# EAGLE design hv_in3 (EAGLE 9.3.1)
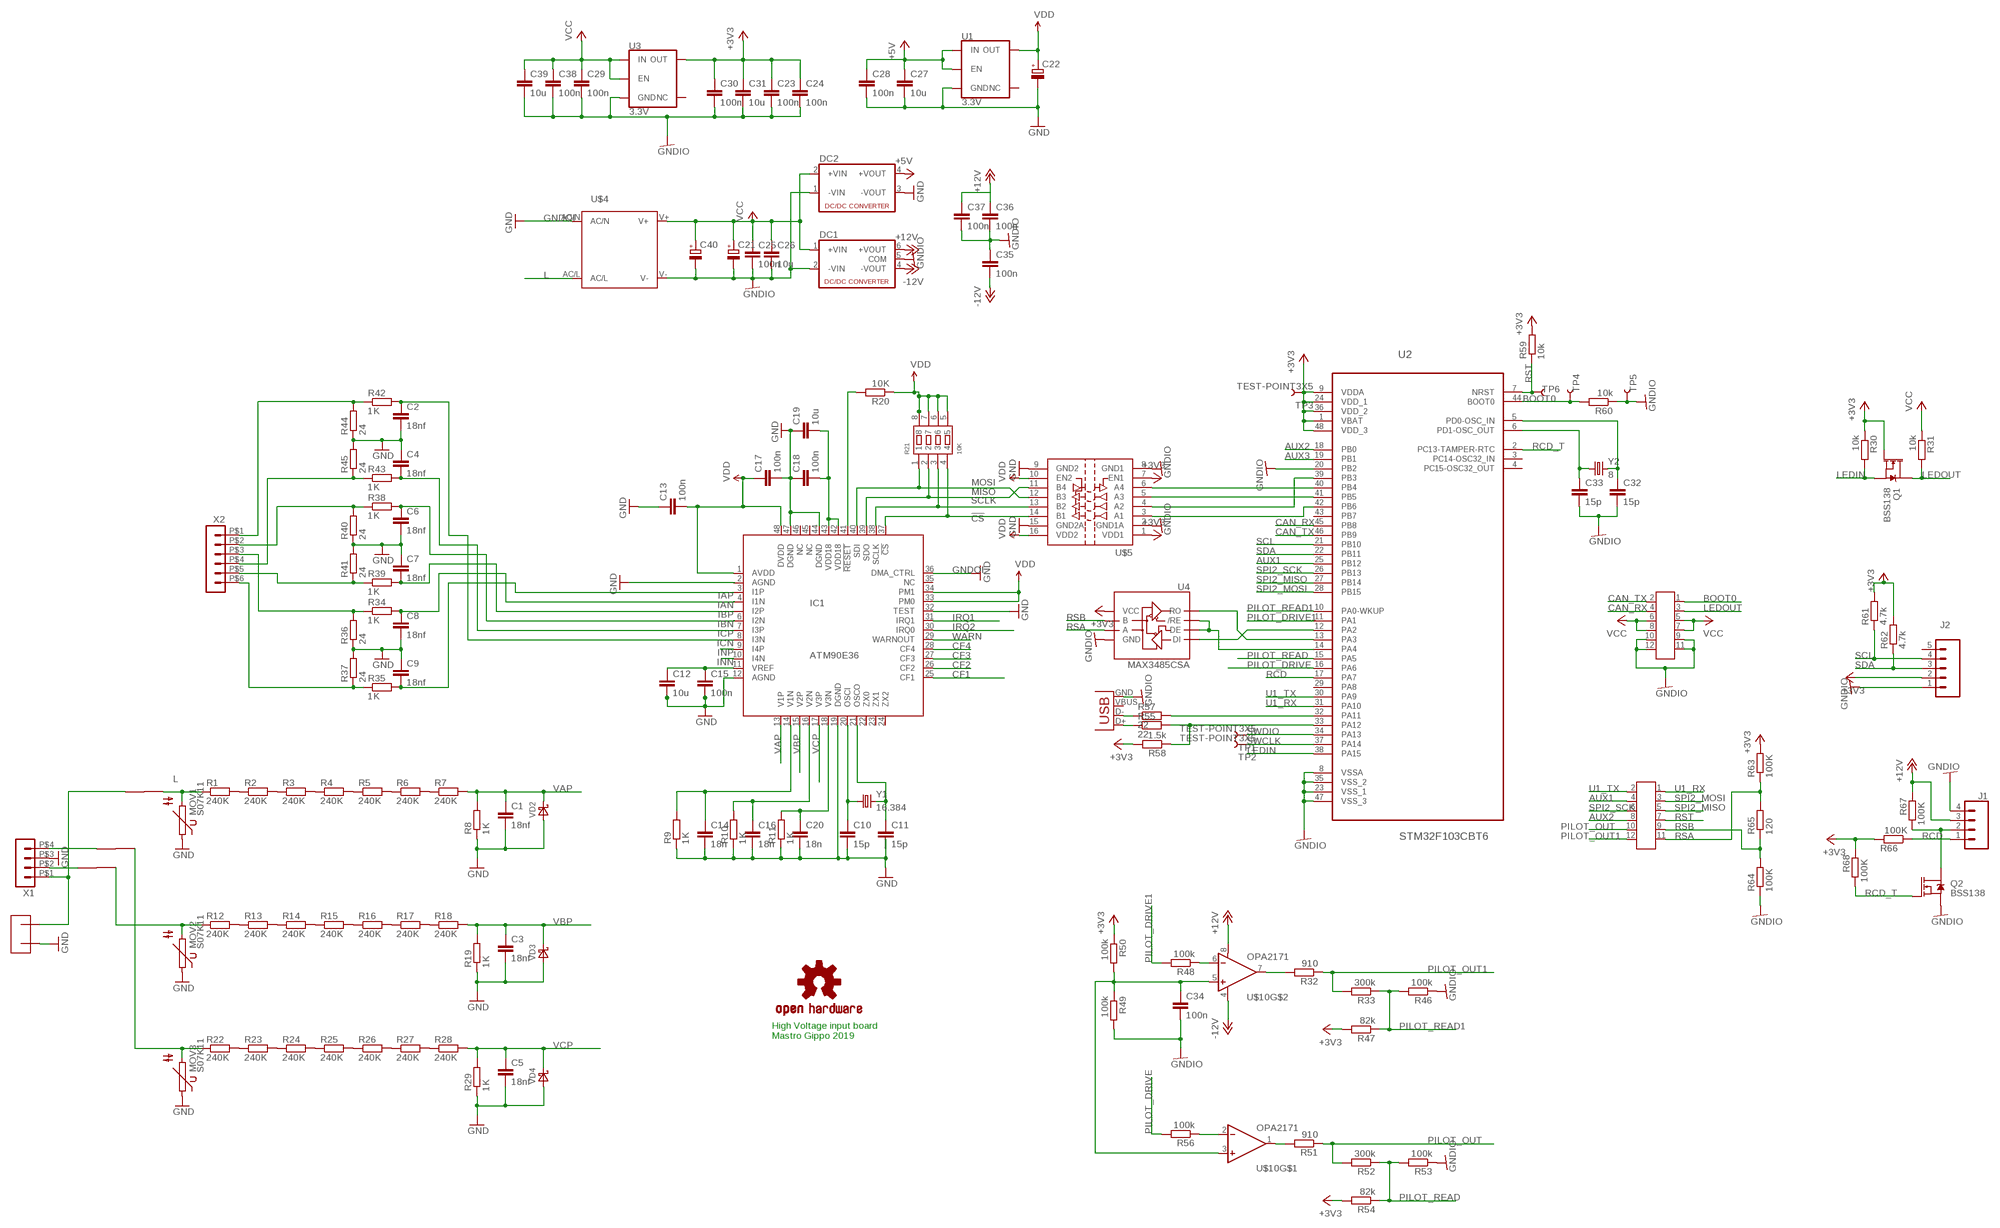
[diagram p0: schematic, sheet 1]

## Parts
C1  18nf  C-EUC0805K  [C0805K]
C2  18nf  C-EUC0805K  [C0805K]
C3  18nf  C-EUC0805K  [C0805K]
C4  18nf  C-EUC0805K  [C0805K]
C5  18nf  C-EUC0805K  [C0805K]
C6  18nf  C-EUC0805K  [C0805K]
C7  18nf  C-EUC0805K  [C0805K]
C8  18nf  C-EUC0805K  [C0805K]
C9  18nf  C-EUC0805K  [C0805K]
C10  15p  C-EUC0805K  [C0805K]
C11  15p  C-EUC0805K  [C0805K]
C12  10u  C-EUC0805K  [C0805K]
C13  100n  C-EUC0805K  [C0805K]
C14  18n  C-EUC0805K  [C0805K]
C15  100n  C-EUC0805K  [C0805K]
C16  18n  C-EUC0805K  [C0805K]
C17  100n  C-EUC0805K  [C0805K]
C18  100n  C-EUC0805K  [C0805K]
C19  10u  C-EUC0805K  [C0805K]
C20  18n  C-EUC0805K  [C0805K]
C21  CPOL-EU153CLV-0505  [153CLV-0505]
C22  CPOL-EU153CLV-0505  [153CLV-0505]
C23  100n  C-EUC0805K  [C0805K]
C24  100n  C-EUC0805K  [C0805K]
C25  100n  C-EUC0805K  [C0805K]
C26  10u  C-EUC0805K  [C0805K]
C27  10u  C-EUC0805K  [C0805K]
C28  100n  C-EUC0805K  [C0805K]
C29  100n  C-EUC0805K  [C0805K]
C30  100n  C-EUC0805K  [C0805K]
C31  10u  C-EUC0805K  [C0805K]
C32  15p  C-EUC0805K  [C0805K]
C33  15p  C-EUC0805K  [C0805K]
C34  100n  C-EUC0805K  [C0805K]
C35  100n  C-EUC0805K  [C0805K]
C36  100n  C-EUC0805K  [C0805K]
C37  100n  C-EUC0805K  [C0805K]
C38  100n  C-EUC0805K  [C0805K]
C39  10u  C-EUC0805K  [C0805K]
C40  CPOL-EUB/3528-21R  [B/3528-21R]
DC1  NMA  [NMA]
DC2  NME  [NME]
IC1  ATM90E36  [TQFP48]
J1  CONN_04SMD2  [1X04_1MM_RA]
J2  CONN_05SMD2  [1X05_1MM_RA]
MOV1  S07K11  [S07K11]
MOV2  S07K11  [S07K11]
MOV3  S07K11  [S07K11]
Q1  BSS138  MOSFET-NCH-BSS138  [SOT23-3]
Q2  BSS138  MOSFET-NCH-BSS138  [SOT23-3]
R1  240K  R_EU  [R0805]
R2  240K  R_EU  [R0805]
R3  240K  R_EU  [R0805]
R4  240K  R_EU  [R0805]
R5  240K  R_EU  [R0805]
R6  240K  R_EU  [R0805]
R7  240K  R_EU  [R0805]
R8  1K  R_EU  [R0805]
R9  1K  R_EU  [R0805]
R10  1K  R_EU  [R0805]
R11  1K  R_EU  [R0805]
R12  240K  R_EU  [R0805]
R13  240K  R_EU  [R0805]
R14  240K  R_EU  [R0805]
R15  240K  R_EU  [R0805]
R16  240K  R_EU  [R0805]
R17  240K  R_EU  [R0805]
R18  240K  R_EU  [R0805]
R19  1K  R_EU  [R0805]
R20  10K  R_EU  [R0805]
R21  10K  SMD-RES-ARRAY-1K-4R(RA1206-8)  [RA1206-8]
R22  240K  R_EU  [R0805]
R23  240K  R_EU  [R0805]
R24  240K  R_EU  [R0805]
R25  240K  R_EU  [R0805]
R26  240K  R_EU  [R0805]
R27  240K  R_EU  [R0805]
R28  240K  R_EU  [R0805]
R29  1K  R_EU  [R0805]
R30  10k  R-EU_R0805  [R0805]
R31  10k  R-EU_R0805  [R0805]
R32  910  R-EU_R1206  [R1206]
R33  300k  R-EU_R0805  [R0805]
R34  1K  R_EU  [R0805]
R35  1K  R_EU  [R0805]
R36  24  R_EU  [R0805]
R37  24  R_EU  [R0805]
R38  1K  R_EU  [R0805]
R39  1K  R_EU  [R0805]
R40  24  R_EU  [R0805]
R41  24  R_EU  [R0805]
R42  1K  R_EU  [R0805]
R43  1K  R_EU  [R0805]
R44  24  R_EU  [R0805]
R45  24  R_EU  [R0805]
R46  100k  R-EU_R0805  [R0805]
R47  82k  R-EU_R0805  [R0805]
R48  100k  R-EU_R0805  [R0805]
R49  100k  R-EU_R0805  [R0805]
R50  100k  R-EU_R0805  [R0805]
R51  910  R-EU_R1206  [R1206]
R52  300k  R-EU_R0805  [R0805]
R53  100k  R-EU_R0805  [R0805]
R54  82k  R-EU_R0805  [R0805]
R55  22  R-EU_R0805  [R0805]
R56  100k  R-EU_R0805  [R0805]
R57  22  R-EU_R0805  [R0805]
R58  1.5k  R-EU_R0805  [R0805]
R59  10k  R-EU_R0805  [R0805]
R60  10k  R-EU_R0805  [R0805]
R61  4.7k  R-EU_R0805  [R0805]
R62  4.7k  R-EU_R0805  [R0805]
R63  100K  R-EU_R0805  [R0805]
R64  100K  R-EU_R0805  [R0805]
R65  120  R-EU_R0805  [R0805]
R66  100K  R-EU_R0805  [R0805]
R67  100K  R-EU_R0805  [R0805]
R68  100K  R-EU_R0805  [R0805]
TP1  TEST-POINT3X5  [PAD.03X.05]
TP2  TEST-POINT3X5  [PAD.03X.05]
TP3  TEST-POINT3X5  [PAD.03X.05]
TP4  TEST-POINT3X5  [PAD.03X.05]
TP5  TEST-POINT3X5  [PAD.03X.05]
TP6  TEST-POINT3X5  [PAD.03X.05]
U1  3.3V  V_REG_AP2112K-3.3V  [SOT23-5]
U2  STM32F103CBT6  [QFP50P900X900X160-48N]
U3  3.3V  V_REG_AP2112K-3.3V  [SOT23-5]
U4  MAX3485CSA  RS485SOIC  [SO08]
U$1  FUSE_2410  [2410_F]
U$2  FUSE_2410  [2410_F]
U$3  FUSE_2410  [2410_F]
U$4  IRM_15/20IRM_15/20  [IRM_15/20]
U$5  SI8441IS1  [SO16]
U$6  ISOLATED_2P  [STRIP_NOMIDDLE]
U$7  CLP-106-02-F-D-P  [CLP-106-02-X-D]
U$8  CLP-106-02-F-D-P  [CLP-106-02-X-D]
U$9  OSHW-LOGOS  [OSHW-LOGO-S]
U$10  OPA2171  [SO08]
VD2  DIODE-SCHOTTKY-SOD523  [SOD523]
VD3  DIODE-SCHOTTKY-SOD523  [SOD523]
VD4  DIODE-SCHOTTKY-SOD523  [SOD523]
X1  HEADER_POS4_43045-0401  [43045-0400]
X2  HEADER_POS6_43045-0600  [43045-0600]
X3  USB-MICROB  [USB-MICROB]
Y1  16.384  CRYSTALSMD-3.2X2.5  [CRYSTAL-SMD-3.2X2.5MM]
Y2  8  CRYSTALSMD-3.2X2.5  [CRYSTAL-SMD-3.2X2.5MM]

## Nets
!CS: IC1.37(!CS) R21.4 U$5.14(B1)
+3V3: C23.1 C24.1 C30.1 C31.1 J2.2 Q1.1(G) R30.1 R47.2 R50.1 R54.2 R58.2 R59.2 R61.2 R62.2 R63.2 R66.2 R68.2 TP3.P$1 U2.1(VBAT) U2.9(VDDA) U2.24(VDD_1) U2.36(VDD_2) U2.48(VDD_3) U3.5(OUT) U4.8(VCC) U$5.1(VDD1) U$5.7(EN1)
+5V: C27.1 C28.1 DC2.4(+VOUT) U1.1(IN) U1.3(EN)
+12V: C36.1 C37.1 DC1.6(+VOUT) J1.3 R67.2 U$10.8(V+)
-12V: C35.2 DC1.4(-VOUT) U$10.4(V-)
AUX1: U2.25(PB12) U$7.4
AUX2: U2.18(PB0) U$7.8
AUX3: U2.19(PB1)
BOOT0: R60.2 TP4.P$1 U2.44(BOOT0) U$8.1
CAN_RX: U2.45(PB8) U$8.4
CAN_TX: U2.46(PB9) U$8.2
CF1: IC1.25(CF1)
CF2: IC1.26(CF2)
CF3: IC1.27(CF3)
CF4: IC1.28(CF4)
GNDIO: C21.- C23.2 C24.2 C25.2 C26.2 C29.2 C30.2 C31.2 C32.2 C33.2 C34.2 C35.1 C36.2 C37.2 C38.2 C39.2 C40.- DC1.2(-VIN) DC1.5(COM) DC2.1(-VIN) J1.4 J2.1 Q2.2(S) R46.1 R49.2 R53.1 R60.1 R64.1 TP5.P$1 U2.8(VSSA) U2.20(PB2) U2.23(VSS_1) U2.35(VSS_2) U2.47(VSS_3) U3.2(GND) U4.5(GND) U$4.V- U$5.2(GND1A) U$5.8(GND1) U$8.9 U$8.10 U$8.11 U$8.12 X3.GND
GNDOI: C1.2 C2.2 C3.2 C4.1 C5.2 C6.2 C7.1 C8.2 C9.1 C10.2 C11.2 C12.2 C13.1 C14.2 C15.2 C16.2 C17.2 C18.1 C19.1 C20.2 C22.- C27.2 C28.2 DC2.3(-VOUT) IC1.2(AGND) IC1.12(AGND) IC1.19(DGND) IC1.32(TEST) IC1.36(DMA_CTRL) IC1.44(DGND) IC1.47(DGND) MOV1.1 MOV2.1 MOV3.1 R8.1 R9.1 R10.1 R11.1 R19.1 R29.1 R36.1 R37.2 R40.1 R41.2 R44.1 R45.2 U1.2(GND) U$4.AC/N U$5.9(GND2) U$5.15(GND2A) U$6.P$2 VD2.A VD3.A VD4.A X1.P$3 ; supply symbol labelled GND
IAN [analog]: C8.1 IC1.4(I1N) R34.2
IAP [analog]: C9.2 IC1.3(I1P) R35.2
IBN [analog]: C6.1 IC1.6(I2N) R38.2
IBP [analog]: C7.2 IC1.5(I2P) R39.2
ICN [analog]: C2.1 IC1.8(I3N) R42.2
ICP [analog]: C4.2 IC1.7(I3P) R43.2
INN [analog]: IC1.10(I4N)
INP [analog]: IC1.9(I4P)
IRQ1: IC1.31(IRQ1)
IRQ2: IC1.30(IRQ0)
L: MOV1.2 R1.1 U$1.P$2 U$4.AC/L
LEDIN: Q1.2(S) R30.2 U2.38(PA15)
LEDOUT: Q1.3(D) R31.2 U$8.3
MISO: IC1.39(SDO) R21.2 U$5.11(B4)
MOSI: IC1.40(SDI) R21.1 U$5.12(B3)
N$1: U$3.P$2 X1.P$4
N$2: R1.2 R2.1
N$3: R2.2 R3.1
N$4: R3.2 R4.1
N$5: R4.2 R5.1
N$6: R5.2 R6.1
N$7: R6.2 R7.1
N$8: U$2.P$2 X1.P$2
N$9: MOV2.2 R12.1 U$2.P$1
N$10: C32.1 U2.5(PD0-OSC_IN) Y2.3
N$11: C33.1 U2.6(PD1-OSC_OUT) Y2.1
N$12: U$1.P$1 U$6.P$1 X1.P$1
N$13: U2.40(PB4) U$5.6(A4)
N$14: U2.41(PB5) U$5.5(A3)
N$15: R12.2 R13.1
N$16: R13.2 R14.1
N$17: R14.2 R15.1
N$18: R15.2 R16.1
N$19: R16.2 R17.1
N$20: R17.2 R18.1
N$21 [analog]: C14.1 IC1.14(V1N) R9.2
N$22 [analog]: C16.1 IC1.16(V2N) R10.2
N$23: U2.39(PB3) U$5.4(A2)
N$24 [analog]: C20.1 IC1.18(V3N) R11.2
N$25: MOV3.2 R22.1 U$3.P$1
N$26: R22.2 R23.1
N$27: R23.2 R24.1
N$28: R24.2 R25.1
N$29: R25.2 R26.1
N$30: R26.2 R27.1
N$31: R27.2 R28.1
N$32 [pwr]: C18.2 C19.2 IC1.42(VDD18) IC1.43(VDD18)
N$33: C10.1 IC1.20(OSCI) Y1.1
N$34: C11.1 IC1.21(OSCO) Y1.3
N$35: R34.1 R36.2 X2.P$3
N$36: R39.1 R41.1 X2.P$5
N$37: U2.42(PB6) U$5.3(A1)
N$38: R55.1 X3.D+
N$39: R57.1 X3.D-
N$40: R43.1 R45.1 X2.P$4
N$41: R57.2 U2.32(PA11)
N$42: R35.1 R37.1 X2.P$6
N$43: R42.1 R44.2 X2.P$1
N$44: R55.2 R58.1 U2.33(PA12)
N$45: R51.2 U$10.1(OUT)
N$46: R56.1 U$10.2(-IN)
N$47: R38.1 R40.2 X2.P$2
N$48: R48.1 U$10.6(-IN)
N$49: C34.1 R49.1 R50.2 U$10.3(+IN) U$10.5(+IN)
N$51: R32.2 U$10.7(OUT)
N$53: U2.12(PA2) U4.4(DI)
N$54: U2.13(PA3) U4.1(RO)
N$55: C12.1 C15.1 IC1.11(VREF)
N$56: U2.14(PA4) U4.2(/RE) U4.3(DE)
N$57: J1.2 Q2.3(D) R67.1
PILOT_DRIVE: R56.2 U2.16(PA6)
PILOT_DRIVE1: R48.2 U2.11(PA1)
PILOT_OUT: R51.1 R52.2 U$7.10
PILOT_OUT1: R32.1 R33.2 U$7.12
PILOT_READ: R52.1 R53.2 R54.1 U2.15(PA5)
PILOT_READ1: R33.1 R46.2 R47.1 U2.10(PA0-WKUP)
RCD: J1.1 R66.1 U2.17(PA7)
RCD_T: Q2.1(G) R68.1 U2.2(PC13-TAMPER-RTC)
RES: IC1.41(!RESET) R20.2
RSA: R63.1 R65.2 U4.6(A) U$7.11
RSB: R64.2 R65.1 U4.7(B) U$7.9
RST: R59.1 TP6.P$1 U2.7(NRST) U$7.7
SCL: J2.4 R61.1 U2.21(PB10)
SCLK: IC1.38(SCLK) R21.3 U$5.13(B2)
SDA: J2.3 R62.1 U2.22(PB11)
SPI2_MISO: U2.27(PB14) U$7.5
SPI2_MOSI: U2.28(PB15) U$7.3
SPI2_SCK: U2.26(PB13) U$7.6
SWCLK: TP2.P$1 U2.37(PA14)
SWDIO: TP1.P$1 U2.34(PA13)
U1_RX: U2.31(PA10) U$7.1
U1_TX: U2.30(PA9) U$7.2
VAP [analog]: C1.1 IC1.13(V1P) R7.2 R8.2 VD2.C
VBP [analog]: C3.1 IC1.15(V2P) R18.2 R19.2 VD3.C
VCC: C21.+ C25.1 C26.1 C29.1 C38.1 C39.1 C40.+ DC1.1(+VIN) DC2.2(+VIN) R31.1 U3.1(IN) U3.3(EN) U$4.V+ U$8.5 U$8.6 U$8.7 U$8.8
VCP [analog]: C5.1 IC1.17(V3P) R28.2 R29.2 VD4.C
VDD [pwr]: C13.2 C17.1 C22.+ IC1.1(AVDD) IC1.33(PM0) IC1.34(PM1) IC1.48(DVDD) R20.1 R21.5 R21.6 R21.7 R21.8 U1.5(OUT) U$5.10(EN2) U$5.16(VDD2)
WARN: IC1.29(WARNOUT)
Unconnected: IC1.22(ZX0) IC1.23(ZX1) IC1.24(ZX2) IC1.35(NC) IC1.45(NC) IC1.46(NC) J2.5 U1.4(NC) U2.3(PC14-OSC32_IN) U2.4(PC15-OSC32_OUT) U2.29(PA8) U2.43(PB7) U3.4(NC) X3.VBUS

## Notes on the sheet
- High Voltage input board
  Mastro Gippo 2019

## Library data of the parts
C1-C20 C23-C39 = resistor:C-EU: CAPACITOR, European symbol
C21 C22 C40 = rcl:CPOL-EU: POLARIZED CAPACITOR, European symbol; SPICEPREFIX: C
DC1 = dc-dc-converter:NMA: DC-DC CONVERTER; MF: C & D TECHNOLOGIES, INC; MPN: NMA0515SC; OC_FARNELL: 1021434; OC_NEWARK: 61K3064
DC2 = dc-dc-converter:NME: DC-DC CONVERTER; MF: C & D TECHNOLOGIES, INC; MPN: NME1205D; OC_FARNELL: 1021466; OC_NEWARK: 98B8198
IC1 = ATM90E36:ATM90E36: ATMEL Poly-phase energy metering; OC_FARNELL: unknown; OC_NEWARK: unknown
J1 = SparkFun-Connectors:CONN_04: Multi connection point. Often used as Generic Header-pin footprint for 0.1 inch spaced/style header connections On any of the 0.1 inch spaced packages, you can populate with these: Break Away Headers - Straight <https://www.sparkfun.com/products/116> (PRT-00116) Break Away Male Headers - Right Angle <https://www.sparkfun.com/products/553> (PRT-00553) Female Headers <https://www.sparkfun.com/products/115> (PRT-00115) Break Away Headers - Machine Pin <https://www.sparkfun.com/products/117> (PRT-00117) Break Away Female Headers - Swiss Machine Pin <https://www.sparkfun.com/products/743> (PRT-00743) For SCREWTERMINALS and SPRING TERMINALS visit here: Screw Terimnals on SparkFun.com <https://www.sparkfun.com/search/results?term=Screw+Terminals> (5mm/3.5mm/2.54mm spacing) This device is also useful as a general connection point to wire up your design to another part of your project. Our various solder wires solder well into these plated through hole pads. Hook-Up Wire - Assortment (Stranded, 22 AWG) <https://www.sparkfun.com/products/11375> (PRT-11375) Hook-Up Wire - Assortment (Solid Core, 22 AWG) <https://www.sparkfun.com/products/11367> (PRT-11367) View the entire wire category on our website here <https://www.sparkfun.com/categories/141> Special notes: Molex polarized connector foot print use with SKU : PRT-08231 with associated crimp pins and housings. 1MM SMD Version SKU: PRT-10208; PROD_ID: CONN-10310; SF_ID: PRT-10208
J2 = SparkFun-Connectors:CONN_05: Multi connection point. Often used as Generic Header-pin footprint for 0.1 inch spaced/style header connections On any of the 0.1 inch spaced packages, you can populate with these: Break Away Headers - Straight <https://www.sparkfun.com/products/116> (PRT-00116) Break Away Male Headers - Right Angle <https://www.sparkfun.com/products/553> (PRT-00553) Female Headers <https://www.sparkfun.com/products/115> (PRT-00115) Break Away Headers - Machine Pin <https://www.sparkfun.com/products/117> (PRT-00117) Break Away Female Headers - Swiss Machine Pin <https://www.sparkfun.com/products/743> (PRT-00743) For SCREWTERMINALS and SPRING TERMINALS visit here: Screw Terimnals on SparkFun.com <https://www.sparkfun.com/search/results?term=Screw+Terminals> (5mm/3.5mm/2.54mm spacing) This device is also useful as a general connection point to wire up your design to another part of your project. Our various solder wires solder well into these plated through hole pads. Hook-Up Wire - Assortment (Stranded, 22 AWG) <https://www.sparkfun.com/products/11375> (PRT-11375) Hook-Up Wire - Assortment (Solid Core, 22 AWG) <https://www.sparkfun.com/products/11367> (PRT-11367) View the entire wire category on our website here <https://www.sparkfun.com/categories/141> Special notes: Molex polarized connector foot print use with SKU : PRT-08231 with associated crimp pins and housings. 1MM SMD Version SKU: PRT-10208
MOV1-MOV3 = varistor:S07K11: VARISTOR
Q1 Q2 = SparkFun-DiscreteSemi:MOSFET-NCH: N-channel MOSFETs Voltage controlled devices that allow control of high current outputs. SparkFun Products: SparkFun OpenScale <https://www.sparkfun.com/products/13261> SparkFun Digital Sandbox <https://www.sparkfun.com/products/12651> SparkFun Monster Moto Shield <https://www.sparkfun.com/products/10182> SparkFun MOSFET Power Controller <https://www.sparkfun.com/products/11214>; PROD_ID: TRANS-00830; VALUE: 220mA/50V/3.5Ω
R1-R20 R22-R29 R34-R45 = mastrogippo:R_EU
R21 = Seeed-Resistor-2016:SMD-RES-ARRAY-1K-4R(RA1206-8): 301030012; MPN: Chip-Array-Series-1%; VALUE: 1K
R30-R33 R46-R68 = resistor:R-EU_: RESISTOR, European symbol
TP1-TP6 = SparkFun:TEST-POINT
U1 U3 = SparkFun-IC-Power:V_REG_AP2112: AP2112 - 600mA CMOS LDO Regulator w/ Enable The AP2112 is CMOS process low dropout linear regulator with enable function, the regulator delivers a guaranteed 600mA (min.) continuous load current. Features Output Voltage Accuracy: ±1.5% Output Current: 600mA (Min.) Foldback Short Current Protection: 50mA Enable Function to Turn ON/OFF VOUT Low Dropout Voltage (3.3V): 250mV (Typ.) @IOUT=600mA Excellent Load Regulation: 0.2%/A (Typ.) Excellent Line Regulation: 0.02%/V (Typ.) Low Quiescent Current: 55μA (Typ.) Low Standby Current: 0.01μA (Typ.) Low Output Noise: 50μVRMS PSRR: 100Hz -65dB, 1kHz -65dB OTSD Protection Stable with 1.0μF Flexible Cap: Ceramic, Tantalum and Aluminum Electrolytic Operation Temperature Range: -40°C to 85°C ESD: MM 400V, HBM 4000V; PROD_ID: VREG-12457
U2 = ST Microelctronics_By_element14_Batch_1:STM32F103CBT6: Medium-density performance line ARM-based 32-bit MCU; MPN: STM32F103CBT6; OC_FARNELL: 1606327; OC_NEWARK: 11N8296; PACKAGE: QFP-48; SUPPLIER: STMICROELECTRONICS
U4 = SparkFun-IC-Comms:RS485: RS-485 Transceiver SP3485 Series 8 Pin NSOIC 3.3 V Low Power Half Duplex RS-485 Transceiver MAX3485 compatible Datasheet <http://www.sparkfun.com/datasheets/Components/General/sp3485CN-LTR.pdf> SparkFun Products SparkFun Transceiver Breakout - RS-485 <https://www.sparkfun.com/products/10124> (BOB-10124) SparkFun USB to RS-485 Converter <https://www.sparkfun.com/products/9822> (BOB-09822); PROD_ID: IC-09388
U$1-U$3 = mastrogippo:FUSE_2410
U$4 = meanwell_irm_v7:IRM_15/20: 15 or 20 watt housing & pin compatible IRM 15 Vout [V] Imax [A] Pmax [W] Eff [%] 3.3 3.5 11.55 74 5 3 15 78 12 1.25 15 82 15 1 15 82 24 0.63 15.12 83 IRM 20 Vout [V] Imax [A] Pmax [W] Eff [%] 3.3 4.5 14.85 76 5 4 20 79 12 1.8 21.6 84 15 1.4 21.6 84 24 0.9 21.6 85
U$5 = silicon-labs:SI8441: Si8441 4 Channel (3/1) Digital Isolator Silicon Labs Si84xx ISOpro digital isolator series. The Si84xx ISOpro digital isolators provide low power galvanic isolation for digital signals. The '41 has three forward and one reverse channel, with output enables. This part is suitable for four wire SPI: unidirectional signals with clock and chip select. They come in speeds of 1Mbps and 150Mbps, and isolation ratings of 1KV, 2.5KV and 5KV. The independent sides use 2.7-5.5V supplies and draw under 5mA per channel. Donald Becker
U$6 = mastrogippo:ISOLATED_2P
U$7 U$8 = mastrogippo:CLP-106-02-F-D-P
U$9 = mastrogippo:OSHW-LOGO: Open Source Hardware Logo This logo indicates the piece of hardware it is found on incorporates a OSHW license and/or adheres to the definition of open source hardware found here: http://freedomdefined.org/OSHW
U$10 = mastrogippo:OPA2171
VD2-VD4 = diode:DIODE-SCHOTTKY-: SCHOTTKY DIODE
X1 = con-molex-micro-fit-3_0:HEADER_POS4_?: Molex - Micro-Fit 3.0 Series connector, 3.00mm (0.118") pitch header, 4 positions.
X2 = con-molex-micro-fit-3_0:HEADER_POS6_?: Molex - Micro-Fit 3.0 Series connector, 3.00mm (0.118") pitch header, 6 positions.
X3 = SparkFun:USB: USB Connectors USB-B-PTH is fully proven SKU : PRT-00139 USB-miniB is fully proven SKU : PRT-00587 USB-A-PCB is untested. USB-A-H is throughly reviewed, but untested. Spark Fun Electronics SKU : PRT-00437 USB-B-SMT is throughly reviewed, but untested. Needs silkscreen touching up. USB-A-S has not been used/tested USB-MB-H has not been used/tested
Y1 Y2 = SparkFun-Clocks:CRYSTAL: Crystals (Generic) These are passive quartz crystals, which can be used as a clock source for a microcontroller. Crystal's are two-terminal devices. They require external "load" capacitors to generate an oscillating signal.

## Net classes
1 pwr: width 0.305 mm, drill 0.356 mm, clearance 0.152 mm
2 analog: width 0.305 mm, drill 0.33 mm, clearance 0.152 mm

## Board
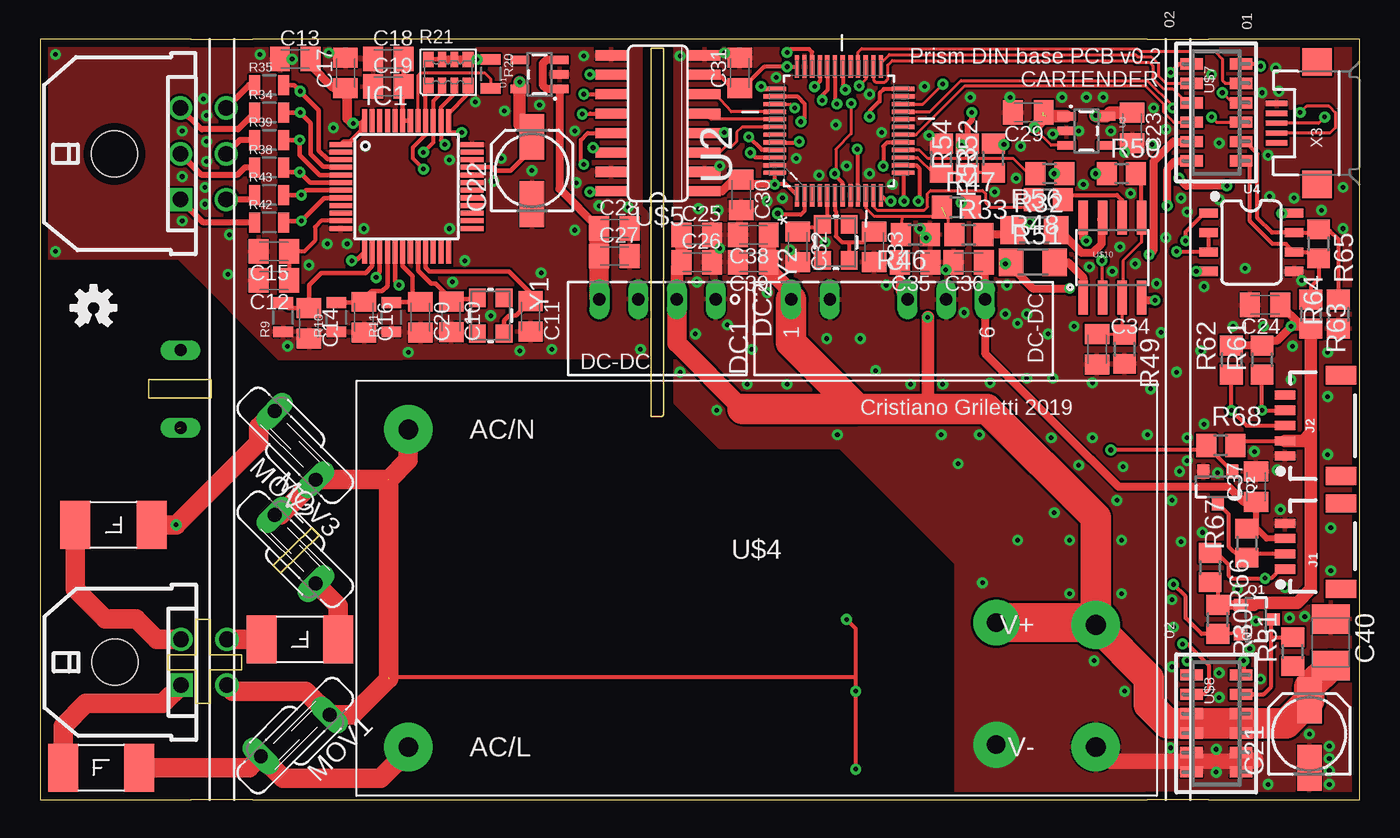
[diagram p1: board, top side]
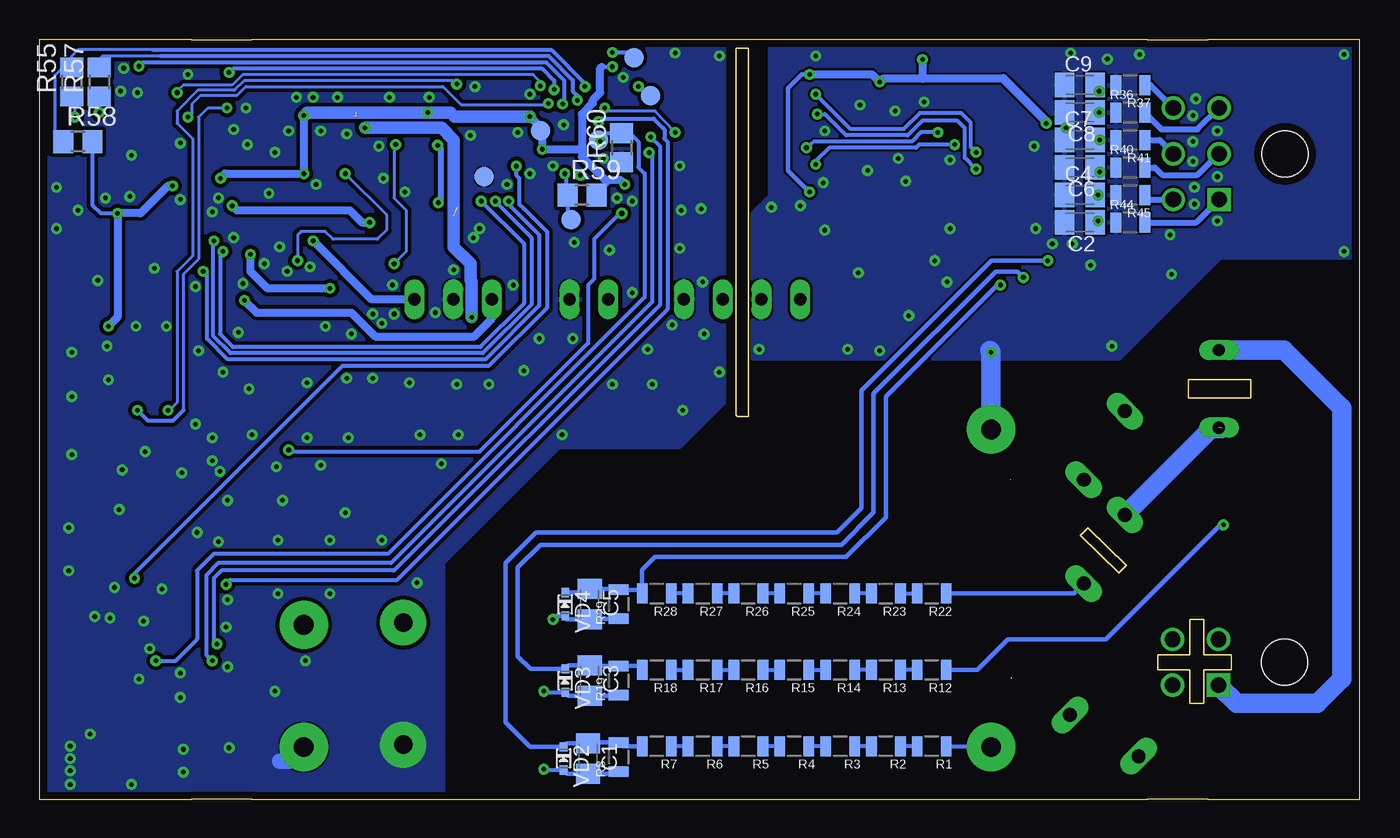
[diagram p2: board, bottom side, seen from below]

Size 86.4 x 49.8 mm. Coordinates in mm from the lower left corner, seen from the top.
Outline: 0,49.8 0,0 9.9,0 9.9,0.04 13.9,0.04 13.9,0 72.5,0 72.5,0.04 76.5,0.04 76.5,0 86.4,0 86.4,49.8 76.5,49.8 76.5,49.76 72.5,49.76 72.5,49.8 13.9,49.8 13.9,49.76 9.9,49.76 9.9,49.8 0,49.8
Copper layers (1*16): Top 0.035mm / dielectric 1.5mm / Bottom 0.035mm
Design rules "default *": minimum track width 6mil, minimum drill 0.29mm, track to track 6mil, track to pad 6mil, pad to pad 6mil, via to via 6mil, smd to smd 0mil, copper to edge 20mil, drill to drill 6mil, minimum pad ring 10mil, minimum via ring 8mil, stop-mask expansion 4mil, vias tented up to drill 0mil, thermal gap 4mil
Milling: 25 lines

### Footprints (pad centres in the part's own frame; a part is rotated, then mirrored left to right if it is on the bottom)
C0805K = smd 1.3 x 1.6: 1 -1,0; 2 1,0
153CLV-0505 = smd 3 x 1.6: + 2.2,0; - -2.2,0
B/3528-21R = smd 1.95 x 2.5: + 1.525,0; - -1.525,0
NMA = drill 0.813 long: 1 0,6.35; 2 0,3.81; 4 0,-1.27; 5 0,-3.81; 6 0,-6.35
NME = drill 0.813 long: 1 0,3.81; 2 0,1.27; 3 0,-1.27; 4 0,-3.81
TQFP48 = smd 1.499 x 0.33: 1 -4.3,2.75; 2 -4.3,2.25; 3 -4.3,1.75; 4 -4.3,1.25; 5 -4.3,0.75; 6 -4.3,0.25; 7 -4.3,-0.25; 8 -4.3,-0.75; 9 -4.3,-1.25; 10 -4.3,-1.75; 11 -4.3,-2.25; 12 -4.3,-2.75; 25 4.3,-2.75; 26 4.3,-2.25; 27 4.3,-1.75; 28 4.3,-1.25; 29 4.3,-0.75; 30 4.3,-0.25; 31 4.3,0.25; 32 4.3,0.75; 33 4.3,1.25; 34 4.3,1.75; 35 4.3,2.25; 36 4.3,2.75 | smd 0.33 x 1.499: 13 -2.75,-4.3; 14 -2.25,-4.3; 15 -1.75,-4.3; 16 -1.25,-4.3; 17 -0.75,-4.3; 18 -0.25,-4.3; 19 0.25,-4.3; 20 0.75,-4.3; 21 1.25,-4.3; 22 1.75,-4.3; 23 2.25,-4.3; 24 2.75,-4.3; 37 2.75,4.3; 38 2.25,4.3; 39 1.75,4.3; 40 1.25,4.3; 41 0.75,4.3; 42 0.25,4.3; 43 -0.25,4.3; 44 -0.75,4.3; 45 -1.25,4.3; 46 -1.75,4.3; 47 -2.25,4.3; 48 -2.75,4.3
1X04_1MM_RA = smd 0.6 x 1.35: 1 -1.5,0; 2 -0.5,0; 3 0.5,0; 4 1.5,0 | smd 1.2 x 2: NC1 2.8,-3.675; NC2 -2.8,-3.675
1X05_1MM_RA = smd 0.6 x 1.35: 1 -2,0; 2 -1,0; 3 0,0; 4 1,0; 5 2,0 | smd 1.2 x 2: NC1 3.3,-3.675; NC2 -3.3,-3.675
S07K11 = drill 0.914 long: 1 -0.635,-2.54; 2 0.635,2.54
SOT23-3 = smd 0.8 x 0.9: 1 -0.95,-1; 2 0.95,-1; 3 0,1.1
R0805 = smd 0.7 x 1.3: 1 -0.95,0; 2 0.95,0
RA1206-8 = smd 0.7 x 1: 1 -1.3,-0.85; 4 1.3,-0.85; 5 1.3,0.85; 8 -1.3,0.85 | smd 0.5 x 1: 2 -0.4,-0.85; 3 0.4,-0.85; 6 0.4,0.85; 7 -0.4,0.85
R0805' = smd 1.3 x 1.5: 1 -0.95,0; 2 0.95,0
R1206 = smd 1.6 x 1.803: 1 -1.422,0; 2 1.422,0
PAD.03X.05 = smd 1.27 x 1.27: P$1 0,0
SOT23-5 = smd 0.55 x 1.2: 1 -0.95,-1.3; 2 0,-1.3; 3 0.95,-1.3; 4 0.95,1.3; 5 -0.95,1.3
QFP50P900X900X160-48N = smd 1.473 x 0.279: 1 -4.216,2.743; 2 -4.216,2.261; 3 -4.216,1.753; 4 -4.216,1.245; 5 -4.216,0.762; 6 -4.216,0.254; 7 -4.216,-0.254; 8 -4.216,-0.762; 9 -4.216,-1.245; 10 -4.216,-1.753; 11 -4.216,-2.261; 12 -4.216,-2.743; 25 4.216,-2.743; 26 4.216,-2.261; 27 4.216,-1.753; 28 4.216,-1.245; 29 4.216,-0.762; 30 4.216,-0.254; 31 4.216,0.254; 32 4.216,0.762; 33 4.216,1.245; 34 4.216,1.753; 35 4.216,2.261; 36 4.216,2.743 | smd 0.279 x 1.473: 13 -2.743,-4.216; 14 -2.261,-4.216; 15 -1.753,-4.216; 16 -1.245,-4.216; 17 -0.762,-4.216; 18 -0.254,-4.216; 19 0.254,-4.216; 20 0.762,-4.216; 21 1.245,-4.216; 22 1.753,-4.216; 23 2.261,-4.216; 24 2.743,-4.216; 37 2.743,4.216; 38 2.261,4.216; 39 1.753,4.216; 40 1.245,4.216; 41 0.762,4.216; 42 0.254,4.216; 43 -0.254,4.216; 44 -0.762,4.216; 45 -1.245,4.216; 46 -1.753,4.216; 47 -2.261,4.216; 48 -2.743,4.216
SO08 = smd 0.6 x 1.2: 1 -1.905,-2.8; 2 -0.635,-2.8; 3 0.635,-2.8; 4 1.905,-2.8; 5 1.905,2.8; 6 0.635,2.8; 7 -0.635,2.8; 8 -1.905,2.8
2410_F = smd 1.96 x 3.15: P$1 -1,0; P$2 4,0
IRM_15/20 = drill 1.3 pad 3.17: AC/L -22.8,-10.4; AC/N -22.8,10.4; V+ 22.2,-2.4; V- 22.2,-10.4
SO16 = smd 0.66 x 2.032: 1 -4.445,-3.073; 2 -3.175,-3.073; 3 -1.905,-3.073; 4 -0.635,-3.073; 5 0.635,-3.073; 6 1.905,-3.073; 7 3.175,-3.073; 8 4.445,-3.073; 9 4.445,3.073; 10 3.175,3.073; 11 1.905,3.073; 12 0.635,3.073; 13 -0.635,3.073; 14 -1.905,3.073; 15 -3.175,3.073; 16 -4.445,3.073
STRIP_NOMIDDLE = drill 0.8 long: P$1 -2.54,0; P$2 2.54,0
CLP-106-02-X-D = smd 0.74 x 1.47: 1 3.175,-1.615; 2 3.175,1.615; 3 1.905,-1.615; 4 1.905,1.615; 5 0.635,-1.615; 6 0.635,1.615; 7 -0.635,-1.615; 8 -0.635,1.615; 9 -1.905,-1.615; 10 -1.905,1.615; 11 -3.175,-1.615; 12 -3.175,1.615
SO08' = smd 0.61 x 2.21: 1 -1.905,-2.616; 2 -0.635,-2.616; 3 0.635,-2.616; 4 1.905,-2.616; 5 1.905,2.616; 6 0.635,2.616; 7 -0.635,2.616; 8 -1.905,2.616
SOD523 = smd 0.6 x 0.5: A 0.762,0; C -0.762,0
43045-0400 = drill 1.02 square: P$1 1.5,4.32 | drill 1.02: P$2 -1.5,4.32; P$3 1.5,7.32; P$4 -1.5,7.32 | hole 3: 0,0
43045-0600 = drill 1.02 square: P$1 3,4.32 | drill 1.02: P$2 0,4.32; P$3 -3,4.32; P$4 3,7.32; P$5 0,7.32; P$6 -3,7.32 | hole 3: 0,0
USB-MICROB = smd 0.35 x 1.4: D+ 0,2.65; D- -0.65,2.65; GND 1.3,2.65; ID 0.65,2.65; VBUS -1.3,2.65 | smd 1.8 x 1.9: MT1 -4,0; MT2 4,0
CRYSTAL-SMD-3.2X2.5MM = smd 1.2 x 1.1: 1 -1.175,-0.875; 2 1.175,-0.875; 3 1.175,0.875; 4 -1.175,0.875

### Placement (x,y rotation side)
C1  50.5,2.7 270 bottom
C2  18.3,37.8 180 bottom
C3  50.4,7.8 270 bottom
C4  18.3,39.6 0 bottom
C5  50.4,12.8 270 bottom
C6  18.3,41.4 180 bottom
C7  18.3,43.2 0 bottom
C8  18.3,45 180 bottom
C9  18.3,46.8 0 bottom
C10  26.91,31.62 270 top
C11  32.11,31.65 270 top
C12  15.3,34 180 top
C13  16.7,48.5 0 top
C14  17.6,31.2 270 top
C15  15.3,35.9 180 top
C16  21.2,31.6 270 top
C17  20,47.6 90 top
C18  22.8,48.5 0 top
C19  22.8,46.7 0 top
C20  24.9,31.6 270 top
C21  83.1,4.3 90 top
C22  32.2,41.2 90 top
C23  71.5,44 270 top
C24  80.2,32.4 180 top
C25  43,37 0 top
C26  43,35.2 0 top
C27  37.6,35.6 0 top
C28  37.6,37.4 0 top
C29  64.7,45 180 top
C30  45.9,39.6 270 top
C31  45.8,47.6 90 top
C32  49.6,36.2 270 top
C33  54.6,36.2 270 top
C34  69.2,29.5 270 top
C35  57.3,35.2 180 top
C36  60.8,35.2 180 top
C37  79.6,20.5 90 top
C38  46.7,37 180 top
C39  46.7,35.2 180 top
C40  84.5,10.3 270 top
DC1  55.52,32.76 90 top
DC2  40.42,32.77 270 top
IC1  23.99,40.16 0 top
J1  81.5,16.6 90 top
J2  81.5,24.5 90 top
MOV1  16.7,4.2 135 top
MOV2  16.7,23.2 45 top
MOV3  16.7,16.4 225 top
Q1  79.6,11.8 270 top
Q2  77.1,20.5 180 top
R1  28,3.5 180 bottom
R2  31,3.5 180 bottom
R3  34,3.5 180 bottom
R4  37,3.5 180 bottom
R5  40,3.5 180 bottom
R6  43,3.5 180 bottom
R7  46,3.5 180 bottom
R8  48.5,2.8 90 bottom
R9  15.9,31.6 90 top
R10  19.4,31.6 90 top
R11  23,31.6 90 top
R12  28,8.5 180 bottom
R13  31,8.5 180 bottom
R14  34,8.5 180 bottom
R15  37,8.5 180 bottom
R16  40,8.5 180 bottom
R17  43,8.5 180 bottom
R18  46,8.5 180 bottom
R19  48.5,7.8 90 bottom
R20  29.5,47.52 270 top
R21  26.72,47.63 0 top
R22  28,13.5 180 bottom
R23  31,13.5 180 bottom
R24  34,13.5 180 bottom
R25  37,13.5 180 bottom
R26  40,13.5 180 bottom
R27  43,13.5 180 bottom
R28  46,13.5 180 bottom
R29  48.5,12.8 90 bottom
R30  10k  [R0805']  77.1,11.8 270 top
R31  10k  [R0805']  82,9.7 90 top
R32  65.1,37.3 0 top
R33  300k  [R0805']  60.8,37 0 top
R34  15,45 0 top
R35  15,46.8 0 top
R36  15,45 0 bottom
R37  15,46.8 180 bottom
R38  15,41.4 0 top
R39  15,43.2 0 top
R40  15,41.4 0 bottom
R41  15,43.2 180 bottom
R42  15,37.8 0 top
R43  15,39.6 0 top
R44  15,37.8 0 bottom
R45  15,39.6 180 bottom
R46  100k  [R0805']  57.3,37 180 top
R47  82k  [R0805']  60,38.8 0 top
R48  100k  [R0805']  66,39.3 180 top
R49  100k  [R0805']  71,29.5 270 top
R50  100k  [R0805']  70.8,41 0 top
R51  65,35.2 0 top
R52  300k  [R0805']  62.4,42 90 top
R53  100k  [R0805']  59,42 270 top
R54  82k  [R0805']  60.7,42 90 top
R55  22  [R0805']  84.3,47 90 bottom
R56  100k  [R0805']  66.1,41 180 top
R57  22  [R0805']  82.5,47 90 bottom
R58  1.5k  [R0805']  83.9,43.1 0 bottom
R59  10k  [R0805']  50.9,39.6 0 bottom
R60  10k  [R0805']  48.3,42.7 90 bottom
R61  4.7k  [R0805']  80,28.8 90 top
R62  4.7k  [R0805']  78,28.8 90 top
R63  100K  [R0805']  83.2,31.8 270 top
R64  100K  [R0805']  85,31.8 90 top
R65  120  [R0805']  83.7,36.4 270 top
R66  100K  [R0805']  76.6,15.2 270 top
R67  100K  [R0805']  79,16.8 90 top
R68  100K  [R0805']  77.3,23.2 0 top
TP1  47.5,48.6 0 bottom
TP2  46.4,46.1 0 bottom
TP3  53.6,43.8 0 bottom
TP4  49.8,43.2 0 bottom
TP5  57.3,40.8 0 bottom
TP6  51.6,38 0 bottom
U1  32.7,47.5 90 top
U2  52.3,43.8 90 top
U3  68.5,43.8 270 top
U4  79.3,36.5 270 top
U$1  2.5,2.1 0 top
U$2  6.3,18 180 top
U$3  18.5,10.5 180 top
U$4  46.91,13.85 0 top
U$5  40.44,44.29 90 top
U$6  9.2,26.9 270 top
U$7  77,45 90 top
U$8  77,5 90 top
U$9  3.5,32.2 0 top
U$10  OPA2171  [SO08']  70.2,35.5 0 top
VD2  52.1,2.7 270 bottom
VD3  52,7.8 270 bottom
VD4  52,12.8 270 bottom
X1  4.9,9 270 top
X2  4.86,42.3 270 top
X3  83.6,44.3 90 top
Y1  29.5,31.7 270 top
Y2  52.1,36.5 90 top

### Tracks (layer width: path | path; a pad name or v marks a point on that pad's centre or on a via)
!CS  (via drill 0.3)
  Top 0.254: R21.4 28.02,46.22 26.74,44.94 IC1.37 26.78,43.7 v27.6,43.7 | v36.2,42.7 37.35,42.4 U$5.14
  Bottom 0.254: v27.6,43.7 28.7,43.7 29.3,43.1 35.7,43.1 v36.2,42.7
+3V3  (via drill 0.3)
  Top 0.2: R54.2 60.61,42.86 v60.35,42.86
  Top 0.254: U2.48 48.08,40.32 | 48.08,40.32 v48.1,40.3 | U2.9 53.55,42.56 v53.5,42.6 | U2.1 48.82,40.32 48.08,40.32 | U2.36 49.54,48 v48.9,48 47.4,48 46,46.6 C31.1 45.3,46.6 44.44,47.47 U$5.7 | R66.2 77.1,14.42 R30.1 | R68.2 78.55,23.5 J2.2 | U2.24 55.24,46.55 54.96,46.26 54.96,45.73 54.3,45.08 v54.3,44.74
  Top 0.406: R47.2 60.6,38.8 v60.3,39.1 | v61,45 61,44.5 60.7,44.2 R54.2
  Top 0.508: R50.1 v69.1,41 | v48.1,40.3 46.2,40.3 46,40.5 | 46,40.5 C30.1 | U$5.1 44.65,39.85 45.3,40.5 46,40.5 | v77.7,40.2 75.06,40.2 v74.56,40.7 | v81.3,38.4 U4.8 | 82.4,31 v81.9,31 80.95,30.05 80.3,30.05 R61.2 R62.2 | 82.4,31 83.15,31 R63.2 | C24.1 82.4,31.2 82.4,31
  Top 0.61: 79.05,12.75 Q1.1 R30.1
  Top 0.813: C23.1 70.05,45 U3.5 69.15,44.75 v69.1,44.8 | 83.2,24 R63.2 | J2.2 82.7,23.5 83.2,24 | 83.2,24 83.2,13.8 82.3,12.9 79.6,12.9 79.45,12.75 79.05,12.75
  Bottom 0.254: 49.6,48 v48.9,48 | R59.2 49.05,40.5 49.3,40.5 49.4,40.6 | R58.2 82.95,38.95 82.4,38.4 v81.3,38.4
  Bottom 0.406: v60.3,39.1 60.15,39.26 60.15,42.66 v60.35,42.86
  Bottom 0.508: v69.1,44.8 v69.1,41 74.26,41 v74.56,40.7 | 54.37,44.8 v54.3,44.74 53.6,44.04 TP3.P$1 53.5,43.7 v53.5,42.6 51,42.6 50.9,42.7 | 50.9,42.7 50.9,44.9 50.2,45.6 50.2,45.8 49.7,46.3 49.7,47.9 49.6,48 | 50.9,42.7 50.9,42.1 49.4,40.6 48.4,40.6 v48.1,40.3 | v81.9,31 81.3,31.6 v81.3,38.4 79.8,38.4 78,40.2 v77.7,40.2
  Bottom 0.813: v54.3,44.74 59.24,44.74 59.5,45 v61,45 68.9,45 v69.1,44.8
+5V
  Top 0.508: U1.3 33.15,48.45 32.9,48.2 32.9,46.8 33.15,46.55 U1.1 34,40 C28.1
  Top 1.27: C28.1 C27.1 36.6,32.88 DC2.4
+12V  (via drill 0.3)
  Top 0.406: J1.3 80.3,17.1 79.65,17.75 | 79.65,17.75 R67.2 | 79.65,17.75 79.55,17.85 79.6,17.9 C37.1
  Top 0.508: C36.1 61.87,35.13 DC1.6 61.87,29.22 68.78,22.32 68.79,22.32 70.6,20.5 77.8,20.5 78.8,19.5 C37.1 | v68.5,36.6 68.3,36.81 U$10.8
  Bottom 0.508: DC1.6 64.66,32.76 v68.5,36.6
-12V  (via drill 0.3)
  Top 0.508: DC1.4 56.3,33.25 C35.2 | v73,32.7 72.12,32.7 U$10.4
  Bottom 0.508: v73,32.7 72.2,31.9 66,31.9 64.4,30.3 58,30.3 56.79,31.51 DC1.4
AUX1
  Top 0.2: U2.25 55.04,48.25 55.6,48.8 71.7,48.8 71.85,48.65 72.75,48.65 73.2,48.2 73.2,47.4 73.7,46.91 U$7.4
AUX2
  Top 0.2: U2.18 57.34,43.55 60.55,46.75 72.36,46.75 73.54,45.57 73.54,45.05 74.22,44.37 U$7.8
BOOT0  (via drill 0.3)
  Top 0.254: v78.8,9.1 78.8,8.36 U$8.1 | U2.44 49.44,43.04 49.5,43.1 v49.7,43.1
  Bottom 0.254: v78.8,9.1 77.5,9.1 76.1,10.5 76.1,15 75,16.1 63.6,16.1 46.8,32.9 46.8,41 47.2,41.4 47.2,43.1 47.75,43.65 R60.2 49.35,43.65 TP4.P$1 v49.7,43.1
CAN_RX  (via drill 0.3)
  Top 0.254: U2.45 47.25,42.56 v46.4,43.4 | v74.8,10.2 75.1,10.2 76.5,8.8 76.5,7.2 76.2,6.9 76.2,6.91 U$8.4
  Bottom 0.254: v46.4,43.4 45.8,42.8 45.8,32.4 63.2,15 74.5,15 75,14.5 75,10.4 v74.8,10.2
CAN_TX  (via drill 0.3)
  Top 0.254: U2.46 46.82,42.05 v46.5,42.37 | v75.1,9.1 75.39,8.82 U$8.2
  Bottom 0.254: v46.5,42.37 46.3,42.17 46.3,32.6 63.4,15.5 74.7,15.5 75.5,14.7 75.5,9.5 v75.1,9.1
GNDIO  (via drill 0.3, 1.2 pad 3)
  Top 1.016: U$4.V- 70.06,2.5 79.5,2.5 79.6,2.6
  Bottom 1.016: U$4.V- 70.06,2.5 70.7,2.5
  other vias: 48.2,47.3 52.1,44.2 54.3,46.2 60.9,46 54.3,41 55.1,43.7 55.8,40.3 53.7,30.2 49.5,42 44.4,38.6 43.1,38.7 47.6,33.2 51.5,30.2 68.5,46 69.6,46 70.1,43.8 72.8,42.9 80.9,47.9 80,46.3 77.2,43 77.2,39.3 82.1,39.4 85.3,40.1 73.7,36.8 74.7,39.4 73.1,33.8 74.4,28 60.5,31.9 48.9,27.2 46.3,27.2 41.9,28 44.3,25.5 52.2,23.9 59,23.9 61.5,23.9 54.7,28.1 62.2,27.3 66.4,18.8 60.1,22 64,17 61.7,14.2 67.4,13.5 70.8,17 68,21.9 70.8,13.5 74.1,13.1 74.2,11.3 79.6,11.7 69,9.1 71,7.1 77,3.3 77,1.8 83.1,4.3 81,21.6 82.8,12 84.3,22.6 80.4,1 78.4,13.8 81.8,11.9 79.2,9.9 84.3,29.3 79.5,22.8 81.9,27.5 78.9,34.8 67.7,31 68.7,34.9 63.3,33.7 66,30.5 55.4,33.7 48.6,39.4 52.8,41.5 58.2,43.5 58,36.8 41.9,48.7 43,33.9 42.9,30.5 70.9,21.8 47.6,39.2 64.6,31.8 63.2,31.8 76.7,47.5 44.8,48.9 44.5,41.5 80.5,39.5 83.9,38.6 80.4,42.2 81.1,46.4 75.1,38.5 76,29.4 73.4,30.6 72.7,26.9 59.1,27.2 57,27.2 73.7,43.9 75.1,23.7 81.5,13.9 84.5,15 81.2,19 84.3,26.4 84.5,17.8 74,3.4 82.6,34 85.3,37.4 80.1,31 82,29.7 78.1,31 76.2,33.6 68.9,27.3 66.3,27.6 74.6,21.5 67.4,17 68.9,23.7 72.5,23.9 76.2,24.6 77.1,21.4 75.1,22.2 45,31.1 46.6,29.5 57.9,46.7 51,40.9 77.2,8.3 49.1,36 51.4,36.5 44.5,36.1 70.5,19.6 66.2,23.7 64.6,27.6 74.1,19.6 76.1,17.5 74.7,16.9 77.2,6.7 74.1,8.7 59.3,34.7 57.6,37.4 62.6,3.6 79.9,7.9 84.4,3.5 84.4,2.7 84.4,1.9 84.4,1 68,43.8 72.9,45.3 63.5,46 71.7,35.1 66.3,43.6 64.2,42.8 66.9,46 63.9,40.7 62.5,39.8 71,42.4 70.7,36.2 70.2,34.6 71.4,39.7 68.3,40.3 64,31.2
  pour Bottom (isolate 0.25): 41.6,49.8 41.6,26 44.5,23.1 52.4,23.1 60,15.5 60,0 86.4,0 86.4,49.8
  pour Top (isolate 0.15): 41.6,49.8 41.6,26 44.5,23.1 52.4,23.1 60,15.5 60,0 86.4,0 86.4,49.8
GNDOI  (via drill 0.3)  (3 unrouted)
  Top 0.254: v53.4,2 v53.4,7.1 53.4,8 | 53.4,8 53.4,11.2 v52.8,11.8 | 53.4,8 22.8,8
  Top 1.27: X1.P$3 12.62,7.1 17.39,7.1 MOV1.1 20.45,5.55 22.8,7.9 22.8,20.95 24.1,22.26 24.1,24.04 24,24.14 | MOV3.1 15.74,18.65 MOV2.1 22.8,20.96
  Top 1.5: 24,24.14 U$4.AC/N
  Bottom 0.254: VD2.A 53.34,1.94 v53.4,2 | v53.4,7.1 53.34,7.04 VD3.A | v52.8,11.8 52.56,12.04 VD4.A
  Bottom 0.305: VD3.A 51.76,6.8 C3.2 48.55,6.8 R19.1 | R8.1 48.65,1.7 C1.2 51.86,1.7 VD2.A | R29.1 50.35,11.85 C5.2 51.9,11.8 52,11.9 52.1,11.9 52.1,11.94 VD4.A
  Bottom 1.27: U$4.AC/N v24.11,29.31 24.2,29.4 | MOV3.1 9.7,24.3 9,24.3
  other vias: 38.5,38.8 33.5,29.5 39.3,29.5 35,37.3 32.8,34.5 26.8,37.4 21.2,37.4 21.3,42.8 26.8,41.9 20.1,36.4 18.8,36.4 17.6,35 12.3,34.4 27.8,35.3 16.2,29.7 12.4,37 9.3,37.9 10.8,39 10.8,40.1 10.9,41.8 9.3,40.8 9.3,43.8 10.9,43.1 10.9,44.8 10.7,45.9 14.4,48.8 1,48.8 1,35.9 18.9,48.9 28.5,45.7 29.7,40.5 35.6,48.7 30.4,45.1 27,33.9 31.4,29.4 32.2,41.2 35.1,40.4 32.7,45.5 36.6,38.9 29.5,31.7 35,43.8 19.2,44 16.5,48.5 30.2,42
  pour Bottom (isolate 0.1): 0,50 38.6,50 38.6,39.5 39.7,38.4 39.7,28.9 15.7,28.9 9.1,35.5 0,35.5
  pour Top (isolate 0.1): 0,50 39.3,50 39.3,38.8 39.7,38.4 39.7,29 15.7,28.9 9.1,35.5 0,35.5
IAN  (via drill 0.3)
  Top 0.305: IC1.4 19.66,41.44 18.54,41.44 17.72,42.27 17.72,44.32 v17.03,45 R34.2
  Bottom 0.305: C8.1 v17.03,45
IAP  (via drill 0.3)
  Top 0.305: IC1.3 19.66,41.94 18.81,41.94 18.25,42.51 18.25,45.15 17.03,46.37 v17.03,46.4 16.63,46.8 R35.2
  Bottom 0.305: C9.2 17.03,46.53 v17.03,46.4
IBN  (via drill 0.3)
  Top 0.305: IC1.6 17.69,40.41 v17,41.1 16.25,41.1 R38.2
  Bottom 0.305: C6.1 v17,41.1
IBP  (via drill 0.3)
  Top 0.305: IC1.5 18.29,40.91 17,42.2 v17,43.2 R39.2
  Bottom 0.305: C7.2 v17,43.2
ICN  (via drill 0.3)
  Top 0.305: IC1.8 18.61,39.41 v17.1,37.9 16.05,37.9 R42.2
  Bottom 0.305: C2.1 17.2,37.9 v17.1,37.9
ICP  (via drill 0.3)
  Top 0.305: IC1.7 17.41,39.91 v17.1,39.6 R43.2
  Bottom 0.305: C4.2 v17.1,39.6
L
  Top 1.27: U$1.P$2 13.7,2.1 MOV1.2 15.91,1.4 22.3,1.4 24.11,3.21 U$4.AC/L
  Bottom 0.254: U$4.AC/L 27,3.45 R1.1
LEDIN  (via drill 0.3)
  Top 0.254: v49.81,44.4 50.06,44.65 50.06,45.57 49.57,46.06 U2.38 | v74.2,14.1 75,13.3 75,11.9 76.05,10.85 R30.2 78.5,10.95 Q1.2
  Bottom 0.254: v49.81,44.4 49.61,44.6 46.2,44.6 45.58,43.98 45.5,43.9 45.5,43.31 45.3,43.1 45.3,32.1 63,14.4 73.9,14.4 v74.2,14.1
LEDOUT
  Top 0.254: 79.4,6.9 79.4,6.91 U$8.3 80.11,6.91 80.6,7.4 80.6,10.6 | 80.6,10.6 80.6,11.7 Q1.3 | R31.2 81.75,10.65 81.7,10.6 80.6,10.6
MISO  (via drill 0.3)
  Top 0.254: R21.2 26.32,46.32 25.74,45.74 IC1.39 25.74,43.04 v25.1,42.4 | v35.6,46.2 U$5.11
  Bottom 0.254: v25.1,42.4 25.44,42.74 25.44,44.34 26.06,44.97 28.79,44.97 29.84,43.92 33.31,43.92 v35.6,46.2
MOSI  (via drill 0.3)
  Top 0.254: R21.1 25.24,46.6 IC1.40 25.24,43.54 24.4,42.7 24.4,42 v25.1,41.3 | v35.5,44.9 36.03,44.93 U$5.12
  Bottom 0.254: v25.1,41.3 25.84,42.04 25.84,43.97 26.33,44.46 28.62,44.46 29.57,43.51 33.61,43.51 35,44.9 v35.5,44.9
N$1
  Top 1.27: X1.P$4 U$3.P$2
N$2
  Bottom 0.254: R1.2 R2.1
N$3
  Bottom 0.254: R2.2 R3.1
N$4
  Bottom 0.254: R3.2 R4.1
N$5
  Bottom 0.254: R4.2 R5.1
N$6
  Bottom 0.254: R5.2 R6.1
N$7
  Bottom 0.254: R6.2 R7.1
N$8
  Top 1.27: X1.P$2 7.64,10.5 6.3,11.85 4.26,11.85 2.3,13.8 U$2.P$2
N$9  (via drill 0.3)
  Top 1.27: U$2.P$1 v8.9,18 14.3,23.4 14.3,24.39 MOV2.2
  Bottom 0.305: R12.1 25,8.5 23,10.5 16.6,10.5 9.1,18 v8.9,18
N$10
  Top 0.254: U2.5 51.54,37.79 51.34,37.79 Y2.3 51.23,37.48 49.88,37.48 C32.1
N$11
  Top 0.254: U2.6 52.05,38.6 52.1,38.55 52.1,36.9 52.5,36.5 52.9,36.5 | 52.9,36.5 53.9,36.5 C33.1 | 52.98,35.13 52.98,35.3 Y2.1 52.98,36.43 52.9,36.5
N$12
  Top 1.27: X1.P$1 8.02,6.3 3,6.3 1.5,4.8 U$1.P$1
  Bottom 1.27: X1.P$1 8.02,6.3 2.74,6.3 1.14,7.9 1.14,25.65 4.94,29.44 U$6.P$1
N$13
  Top 0.203: U2.40 45.26,45.05 44.21,46.2 U$5.6
N$14
  Top 0.203: U2.41 43.95,44.56 U$5.5
N$15
  Bottom 0.254: R12.2 R13.1
N$16
  Bottom 0.254: R13.2 R14.1
N$17
  Bottom 0.254: R15.1 R14.2
N$18
  Bottom 0.254: R16.1 R15.2
N$19
  Bottom 0.254: R17.1 R16.2
N$20
  Bottom 0.254: R18.1 R17.2
N$21
  Top 0.305: IC1.14 21.74,34.94 21.3,34.5 18.4,34.5 17.6,33.7 C14.1 16.25,32.2 R9.2
N$22
  Top 0.305: IC1.16 22.74,33.64 22.4,33.3 21.7,33.3 21.2,32.8 C16.1 21.15,32.55 R10.2
N$23  (via drill 0.3)
  Top 0.203: U$5.4 43.56,43.7 v44.8,43.7 | U2.39 49.15,45.56 v49.4,45.3
  Bottom 0.203: v44.8,43.7 46.1,45.1 49.2,45.1 v49.4,45.3
N$24
  Top 0.305: IC1.18 23.74,34.96 24.4,34.3 24.4,32.6 C20.1 23.05,32.6 R11.2
N$25
  Top 1.27: MOV3.2 19.5,12.7 U$3.P$1
  Bottom 0.305: R22.1 18.7,13.5 MOV3.2
N$26
  Bottom 0.254: R23.1 R22.2
N$27
  Bottom 0.254: R23.2 R24.1
N$28
  Bottom 0.254: R24.2 R25.1
N$29
  Bottom 0.254: R25.2 R26.1
N$30
  Bottom 0.254: R26.2 R27.1
N$31
  Bottom 0.254: R27.2 R28.1
N$32
  Top 0.305: IC1.42 IC1.43 23.74,46.64 C19.2 C18.2
N$33
  Top 0.254: Y1.1 28.54,32.79
  Top 0.305: IC1.20 24.74,34.66 25.6,33.8 25.9,33.8 26.91,32.79 | 26.91,32.79 C10.1 | 28.54,32.79 26.91,32.79
N$34
  Top 0.305: IC1.21 25.24,34.86 25.5,34.6 30.7,34.6 32.11,33.19 C11.1 31.16,31.7 30.7,31.7 30.38,31.38 Y1.3
N$35
  Top 0.406: R36.2 12.95,43.9 10.58,43.9 X2.P$3
  Bottom 0.406: R36.2 12.95,43.9 10.6,43.9 9.2,45.3 X2.P$3
N$36
  Top 0.406: X2.P$5 13.08,43.2 R39.1
  Bottom 0.406: R39.1 13.08,43.2 X2.P$5
N$37
  Top 0.203: U2.42 45.95,44.06 45.6,43.7 45.6,43.1 45.3,42.8 44.9,42.8 44.49,42.39 U$5.3
N$38  (via drill 0.3)
  Top 0.2: v84.1,44.7 83.7,44.3 X3.D+
  Bottom 0.2: R55.1 84.1,46.05 v84.1,44.7
N$39  (via drill 0.3)
  Top 0.2: v82.5,45 82.9,45.4 84.4,45.4 84.8,45 84.8,44 84.45,43.65 X3.D-
  Bottom 0.2: R57.1 v82.5,45
N$40
  Top 0.406: X2.P$4 13.75,39.3 R43.1
  Bottom 0.406: R43.1 13.75,39.3 X2.P$4
N$41  (via drill 0.3)
  Top 0.254: U2.32 51.54,46.47 51.2,46.11 v51.2,45.8
  Bottom 0.2: 78.51,48.7 82.3,48.7 82.5,48.5 R57.2
  Bottom 0.254: 78.51,48.7 53.07,48.7 51.5,47.13 51.5,46.4 51.2,46.1 v51.2,45.8
N$42
  Top 0.406: R35.1 13.68,46.8 X2.P$6
  Bottom 0.406: R35.1 13.68,46.8 X2.P$6
N$43
  Top 0.406: R44.2 10.68,37.8 X2.P$1
  Bottom 0.406: X2.P$1 10.68,37.8 R44.2
N$44  (via drill 0.3)
  Top 0.254: U2.33 51.06,47.06 v50.7,46.7
  Bottom 0.2: 79,49.1 83.9,49.1 84.3,48.7 R55.2 84.9,47.95 85.4,47.45 85.4,43.75 R58.1
  Bottom 0.254: 79,49.1 52.9,49.1 50.7,46.9 v50.7,46.7
N$45
  Top 0.508: R51.2 67.3,35.2 68.3,34.2 U$10.1
N$46  (via drill 0.3)
  Top 0.2: R56.1 v66.4,41 | v69.52,35.31 69.52,32.93 U$10.2
  Bottom 0.2: v66.4,41 63.7,38.3 63.7,37.3 64.3,36.7 67.2,36.7 67.71,37.21 69.29,37.21 69.5,37 69.5,35.31 v69.52,35.31
N$47
  Top 0.406: R40.2 13.4,41.4 12.9,40.9 10.58,40.9 X2.P$2
  Bottom 0.406: R40.2 13.4,41.4 12.9,40.9 10.6,40.9 9.2,42.3 X2.P$2
N$48
  Top 0.254: R48.1 66.8,39.3 67.1,39.6 70.5,39.6 70.84,39.27 U$10.6
N$49
  Top 0.2: U$10.5 72.11,36.51 70.9,35.3 70.9,32.95 U$10.3 70.84,30.62 R49.1 70.95,30.5 C34.1
  Top 0.254: U$10.5 72.11,40.55 R50.2
  Top 0.508: C34.1 69.55,30.5 69.57,30.52 | 72.11,37.31 U$10.5
N$51
  Top 0.508: U$10.7 69.47,38.02 69.47,36.37 68.9,35.8 68.2,35.8 66.7,37.3 R32.2
N$53  (via drill 0.3)
  Top 0.254: U2.12 55.43,39.2 v55.7,39.2
  Top 0.508: v75.7,34.6 76.11,34.6 U4.4
  Bottom 0.254: v55.7,39.2 55.7,39 53.7,37 53.7,32.35 57.22,28.83 74.08,28.83 75.44,30.19 75.44,34.34 v75.7,34.6
N$54  (via drill 0.3)
  Top 0.254: U2.13 56.52,39.25 v56.56,39.2 | v75,36.6 75,37.2 76.21,38.41 U4.1
  Bottom 0.254: v56.56,39.2 56.33,38.98 56.33,38.94 54.2,36.81 54.2,32.43 57.39,29.24 73.91,29.24 75.03,30.36 75.03,36.26 v75,36.6
N$55
  Top 0.254: IC1.11 18.41,37.91 18,37.5 18,36.6 17.3,35.9 C15.1 C12.1
N$56  (via drill 0.3)
  Top 0.254: U2.14 57.38,41.54 57.56,41.36 57.56,39.26 v57.5,39.2 | v74.4,35.9 76.37,35.9 U4.3 U4.2
  Bottom 0.254: v57.5,39.2 54.7,36.4 54.7,32.5 57.56,29.64 73.74,29.64 74.6,30.5 74.6,35.7 v74.4,35.9
N$57
  Top 0.254: Q2.3 77.8,18.7 77.8,16.6 78.55,15.85 R67.1 | J1.2 79.25,16.1
  Top 0.406: 79.25,16.1 R67.1
PILOT_DRIVE
  Top 0.2: R56.2 64.69,41 63.69,42 58.1,42 57.55,42.56 U2.16
PILOT_DRIVE1
  Top 0.2: 54.8,38.6 57.89,38.6 58.11,38.81 58.11,39.45 58.1,39.46 58.1,39.7 58.3,39.9 61.7,39.9 61.9,39.7 61.9,39.1 62.2,38.8 65,38.8 65.05,38.85 R48.2
  Top 0.203: U2.11 54.56,38.83 54.8,38.6
PILOT_OUT  (via drill 0.3)
  Top 0.2: R52.2 63.05,42.95 v63.1,42.9 | v63.2,35.1 63.3,35.2 R51.1
  Top 0.508: R51.1 63.58,34.9 64.99,33.49 v67.4,33.49 | v72.6,35.7 72.9,36 72.9,41.8 74.2,43.1 U$7.10
  Bottom 0.2: v63.1,42.9 63.2,42.8 63.2,39.4 62.4,38.6 62.4,35.9 v63.2,35.1
  Bottom 0.508: v67.4,33.49 71.49,33.49 72.6,34.6 v72.6,35.7
PILOT_OUT1  (via drill 0.3)
  Top 0.254: 75.36,41.8 U$7.12
  Top 0.508: R33.2 63.38,37 R32.1 63.78,37.4 63.78,37.8 v64.8,37.8 | v73.8,38.9 73.8,41.3 74.3,41.8 75.36,41.8
  Bottom 0.508: v73.8,38.9 73.5,38.6 66.1,38.6 65.3,37.8 v64.8,37.8
PILOT_READ
  Top 0.2: R52.1 R54.1 R53.2 58.45,41.05 57.45,42.05 U2.15
PILOT_READ1  (1 unrouted)
  Top 0.2: 59.3,38.2 59.45,38.05 59.45,37.4 R33.1
  Top 0.203: U2.10 54.05,38.75 54.6,38.2 56.5,38.2 | 56.5,38.2 59.3,38.2 | R46.2 56.45,38.15 56.5,38.2
RCD  (via drill 0.3)
  Top 0.254: U2.17 55.45,43.04 55.2,42.79 v55.2,41.49 | J1.1 81.2,15.1 80.6,14.5 v80.2,14.5 78,14.5 77.8,14.7 77.8,15.4 77.3,15.9 76.85,15.9 R66.1
  Bottom 0.254: v55.2,41.49 55.2,40.9 55,40.7 55,39 54.7,38.7 53.2,37.2 53.2,32.2 57,28.4 66.6,28.4 80.2,14.8 v80.2,14.5
RCD_T  (via drill 0.3, 0.35)
  Top 0.254: Q2.1 76.65,22.9 76.3,22.9 | 76.3,22.9 v70.1,22.9 | R68.1 76.3,23.15 76.3,22.9 | U2.2 50.04,38.54 49.8,38.3 48.4,38.3 v48.3,38.4
  Bottom 0.254: v70.1,22.9 70,22.8 57.6,22.8 50.5,29.9 50.5,33.7 50.1,34.1 50.1,36.7 48.4,38.4 v48.3,38.4
RES
  Top 0.203: IC1.41 24.74,47.44 24.9,47.6 29.1,47.6 29.5,47.2 R20.2
RSA
  Top 0.254: R63.1 83.2,33.6 83.7,34.1 R65.2 83.39,35.87 U4.6 81.57,36.4 80.7,36.4 79.2,37.9 79.2,41.6 78.98,41.83 U$7.11
RSB
  Top 0.254: R64.2 85,36.7 84.45,37.25 R65.1 83.59,37.14 U4.7 80.67,37.14 79.7,38.1 79.7,42.3 78.91,43.1 U$7.9
RST  (via drill 0.3)
  Top 0.2: v76.7,44.7 77.04,44.37 U$7.7 | v53.1,45.59 53.1,43.6 52.1,42.6 52.1,41 v52.02,41
  Top 0.254: U2.7 52.55,40.36 51.97,40.95 v52.02,41
  Bottom 0.2: v76.7,44.7 76.45,44.96 76.45,45.55 75.91,46.1 73.51,46.1 72.9,46.7 60,46.7 58.8,45.5 53.19,45.5 v53.1,45.59
  Bottom 0.254: v52.02,41 51.95,40.94 51.95,39.7 R59.1 51.85,38.25 TP6.P$1
SCL  (via drill 0.3)
  Top 0.2: U2.21 58.25,45.05 60.3,47.1 72.5,47.1 74.14,45.46 v74.14,45.3
  Top 0.254: J2.4 v80,25.5 R61.1
  Bottom 0.2: v74.14,45.3 75.4,45.3 76,44.7 76,35.4 77.01,34.4 77.01,25.5
  Bottom 0.254: 77.01,25.5 77.7,24.8 79.3,24.8 v80,25.5
SCLK  (via drill 0.3)
  Top 0.254: R21.3 27.12,46.22 26.24,45.34 IC1.38 26.24,43.16 v26.5,42.9 | v35.6,41.6 35.6,41.8 35.4,41.8 35.4,43.2 35.86,43.66 U$5.13
  Bottom 0.254: v26.5,42.9 28.83,42.9 29.03,42.7 34.71,42.7 35.6,41.8 v35.6,41.6
SDA  (via drill 0.3)
  Top 0.2: U2.22 57.79,45.56 v59.1,46.86
  Top 0.254: R62.1 v78,25.5 79,24.5 J2.3
  Bottom 0.2: v59.1,46.86 59.34,47.1 73,47.1 73.65,46.45 76.05,46.45 77.4,45.1 77.4,44.3 76.4,43.3 76.4,35.6 77.4,34.6 77.4,26 77.9,25.5 v78,25.5
SPI2_MISO  (via drill 0.3)
  Top 0.2: U2.27 54.05,47.18 v53.63,46.75 | U$7.5 78.07,45.64 v77.4,46.3
  Bottom 0.2: v53.63,46.75 53.63,47.03 54.09,47.49 73.11,47.49 73.8,46.8 77,46.8 77.6,46.2 v77.4,46.3
SPI2_MOSI
  Top 0.2: U2.28 53.55,48.95 53.79,49.19 71.81,49.19 72,49 76.9,49 77.4,48.5 77.4,47.1 77.6,46.91 U$7.3
SPI2_SCK
  Top 0.2: U2.26 54.56,47.14 54.7,47 55.3,47 55.5,47.2 55.5,48.1 55.8,48.4 71.6,48.4 71.71,48.3 72.61,48.3 72.85,48.06 72.85,47.26 73.55,46.56 74.15,46.56 75.07,45.64 U$7.6
SWCLK  (via drill 0.3)
  Top 0.254: U2.37 47.36,46.55 v47.2,46.71
  Bottom 0.254: v47.2,46.71 46.59,46.1 TP2.P$1
SWDIO  (via drill 0.3)
  Top 0.254: U2.34 50.55,48.96 50.34,49.16 49.13,49.16 v48.9,48.94
  Bottom 0.254: v48.9,48.94 47.94,48.94 TP1.P$1
U1_RX  (via drill 0.3)
  Top 0.254: U2.31 52.05,45.67 v52.16,45.56 | v79.9,48.04 79.74,48.18 U$7.1
  Bottom 0.254: v52.16,45.56 52.06,45.66 52.06,47.12 53.23,48.28 79.66,48.28 v79.9,48.04
U1_TX  (via drill 0.3)
  Top 0.254: U2.30 52.55,46.67 v52.72,46.5 | v74,47.62 74.56,48.18 U$7.2
  Bottom 0.254: v52.72,46.5 52.72,47.1 53.49,47.87 73.75,47.87 v74,47.62
VAP  (via drill 0.3)
  Top 0.305: IC1.13 20.78,35.4 20.5,35.4 v20.4,35.3
  Bottom 0.305: v20.4,35.3 24.1,35.3 32.6,26.8 32.6,19.1 34.2,17.5 53.9,17.5 55.9,15.5 55.9,5.06 54.3,3.46 VD2.C 51.86,3.7 C1.1 50.45,3.75 R8.2 48.25,3.5 R7.2
VBP  (via drill 0.3)
  Top 0.305: v22,34.2 22,34.3 22.24,34.54 IC1.15
  Bottom 0.305: v22,34.2 22.4,34.6 23.8,34.6 31.8,26.6 31.8,18.8 33.9,16.7 53.6,16.7 55.1,15.2 55.1,9.4 54.26,8.56 VD3.C 51.76,8.8 C3.1 50.35,8.75 R19.2 47.2,8.75 R18.2
VCC  (via drill 0.3, 1.2 pad 3)  (2 unrouted)
  Top 0.2: U$8.7 79,4.75 79,5 78.62,5.39 U$8.5 | U$8.6 75.39,5.02 75.4,5 U$8.8 | v65.1,44 65.1,43.95 66.19,42.85 U3.3
  Top 0.254: R31.1 83.1,7.65 83.1,7.38
  Top 0.305: U3.1 67.15,44.8 66.9,44.8
  Top 0.813: DC2.2 41.69,34.89 C26.1 C25.1 | v58.11,31.6 58.11,25.61 58.1,25.6 | 65.7,44.8 65.5,44.6 | U3.1 65.85,44.75 v65.1,44
  Top 1.016: C38.1 C39.1 47.7,34.7 49.17,33.23 DC1.1
  Top 1.27: DC2.2 41.69,29.91 46,25.6
  Top 2: 53.5,25.6 58.1,25.6 62,25.6 69.11,18.49 U$4.V+ 72.6,7.96 72.6,6.2 73.8,5 75.4,5 79,5 81.6,5 C21.+ 83.1,7.38 C40.+ | 53.5,25.6 49.17,29.93 DC1.1 | 46,25.6 53.5,25.6
  Top 2.54: v62.6,11.6 68.96,11.6 U$4.V+
  Bottom 0.813: v58.11,31.6 58.11,33.93 58.2,34.02 58.2,35.1 59.3,36.2 59.3,43.2 60.1,44 v65.1,44
VCP  (via drill 0.3)
  Top 0.305: v23.5,33.7 23.24,33.96 IC1.17
  Bottom 0.305: VD4.C 50.64,13.56 C5.1 48.55,13.8 R29.2 47.2,13.75 R28.2 46.95,15.05 46.1,15.9 33.6,15.9 31,18.5 31,26.4 23.7,33.7 v23.5,33.7
VDD  (via drill 0.3)
  Top 0.305: IC1.1 19.88,43.1 20.3,43.1 21,43.8 21,44.3 | 21,44.3 21.16,44.46 IC1.48 | v20.5,44.3 21,44.3 | U$5.10 36.04,47.47 v36,47.5 | U$5.16 36.05,39.85 v36,39.8 | C17.1 20.1,46.5 20.1,46.42 | R21.8 R21.7 | R21.5 v28.6,48.47 | IC1.34 IC1.33 29.59,41.41 29.79,41.21 30.81,41.21 32.2,42.6 C22.+
  Top 0.508: R21.7 R21.6 R21.5 | R20.1 v28.6,48.47 | C17.1 19.2,46.6 17.7,48.1 C13.2
  Top 0.61: v20.5,44.3 20.4,44.3 20.1,44.6 20.1,46.42
  Top 0.813: v31.4,47 U1.5 31.4,44.2 C22.+ | v31.4,47
  Bottom 0.305: v36,39.8 37.4,41.2 37.4,46.6 36.5,47.5 v36,47.5
  Bottom 0.508: v36,47.5 31.9,47.5 v31.4,47 31.2,47.2 28.6,47.2 | 23.3,47.2 28.6,47.2 | v28.6,48.47 28.6,47.2
  Bottom 0.61: 23.3,47.2 20.5,44.4 v20.5,44.3

### Text on the board
tNames: Prism DIN base PCB v0.2 | CARTENDER | Cristiano Griletti 2019